# EAGLE schematic 0127_microphone_type_J (EAGLE 9.6.2)

## Sheet 1 of 2
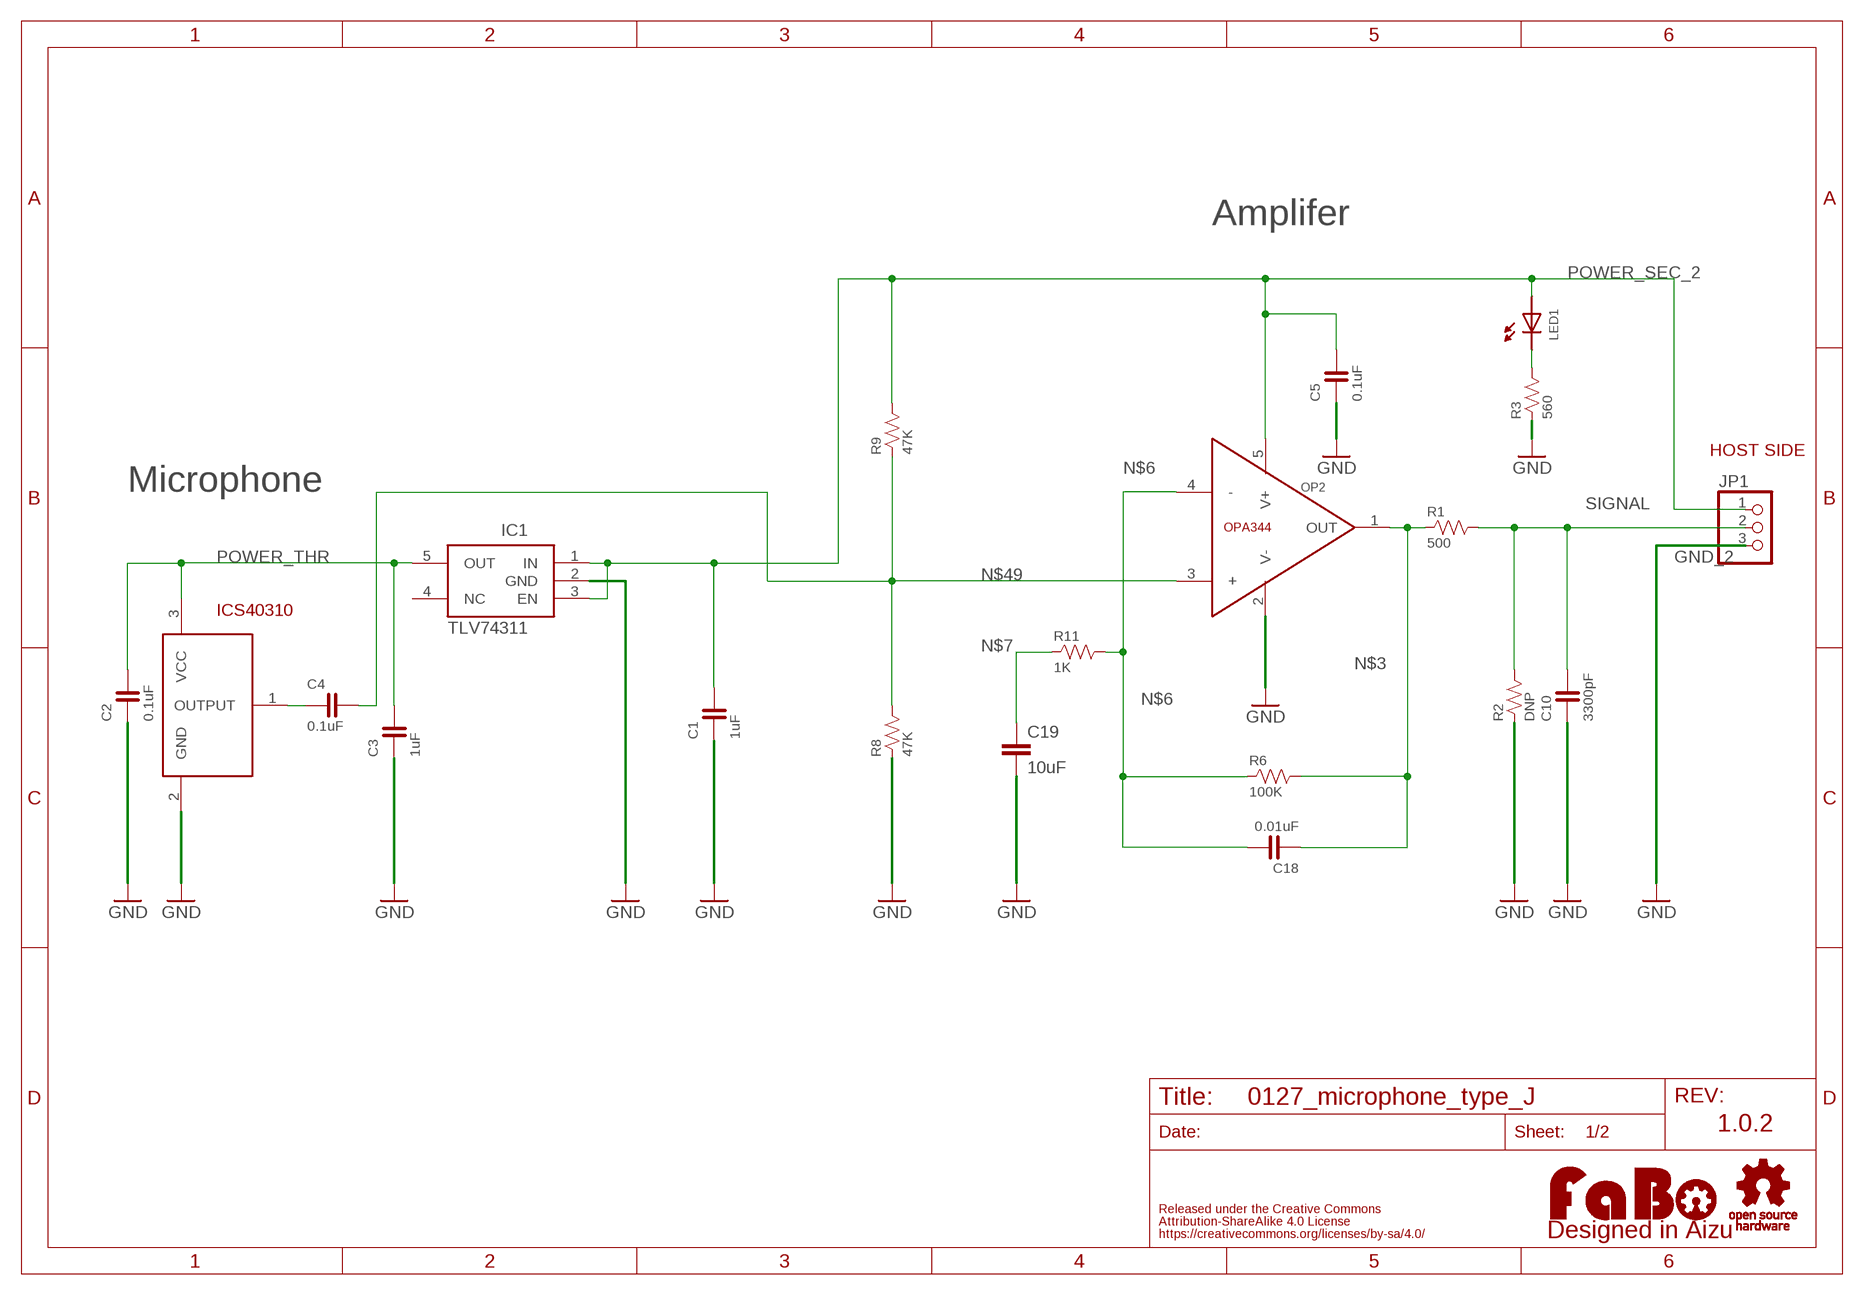
[diagram p0: schematic, sheet 1]

### Parts
C1  1uF  CAPACITOR-0603  [0603]
C2  0.1uF  CAPACITOR-0603  [0603]
C3  1uF  CAPACITOR-0603  [0603]
C4  0.1uF  CAPACITOR-0603  [0603]
C5  0.1uF  CAPACITOR-0603  [0603]
C10  3300pF  CAPACITOR-0603  [0603]
C18  0.01uF  CAPACITOR-0603  [0603]
C19  10uF  C-EUC1206K  [C1206K]
IC1  TLV74311  [SOT-23-5]
ICS40310  ANALOG-MICICS40310  [ICS40310]
JP1  PINHD-1X3  [1X03]
LED1  LED-0603-NARROW  [0603-NARROW]
LOGO1  LOGO_FABO-S  [LOGO_FABO_S]
OP2  OPA344  [SOT23-5]
R1  500  RESISTOR-0603  [0603]
R2  DNP  RESISTOR-0603  [0603]
R3  560  RESISTOR-0603  [0603]
R6  100K  RESISTOR-0603  [0603]
R8  47K  RESISTOR-0603  [0603]
R9  47K  RESISTOR-0603  [0603]
R11  1K  RESISTOR-0603  [0603]
U$2  LOGO_OSHW-S  [LOGO_OSHW_S]

### Nets
GND_2: C1.1 C2.1 C3.1 C5.1 C10.1 C19.2 IC1.2(GND) ICS40310.2(GND) JP1.3 OP2.2(V-) R2.1 R3.1 R8.1 ; supply symbol labelled GND
N$3: C18.1 OP2.1(OUT) R1.1 R6.2
N$4: C4.1 ICS40310.1(OUTPUT)
N$5: LED1.CATHODE R3.2
N$6: C18.2 OP2.4(-) R6.1 R11.2
N$7: C19.1 R11.1
N$49: C4.2 OP2.3(+) R8.2 R9.1
POWER_SEC_2: C1.2 C5.2 IC1.1(IN) IC1.3(EN) JP1.1 LED1.ANODE OP2.5(V+) R9.2
POWER_THR: C2.2 C3.2 IC1.5(OUT) ICS40310.3(VCC)
SIGNAL: C10.2 JP1.2 R1.2 R2.2
Unconnected: IC1.4(NC)

### Notes on the sheet
- Amplifer
- HOST SIDE
- Microphone
- ICS40310
- 1.0.2

## Sheet 2 of 2
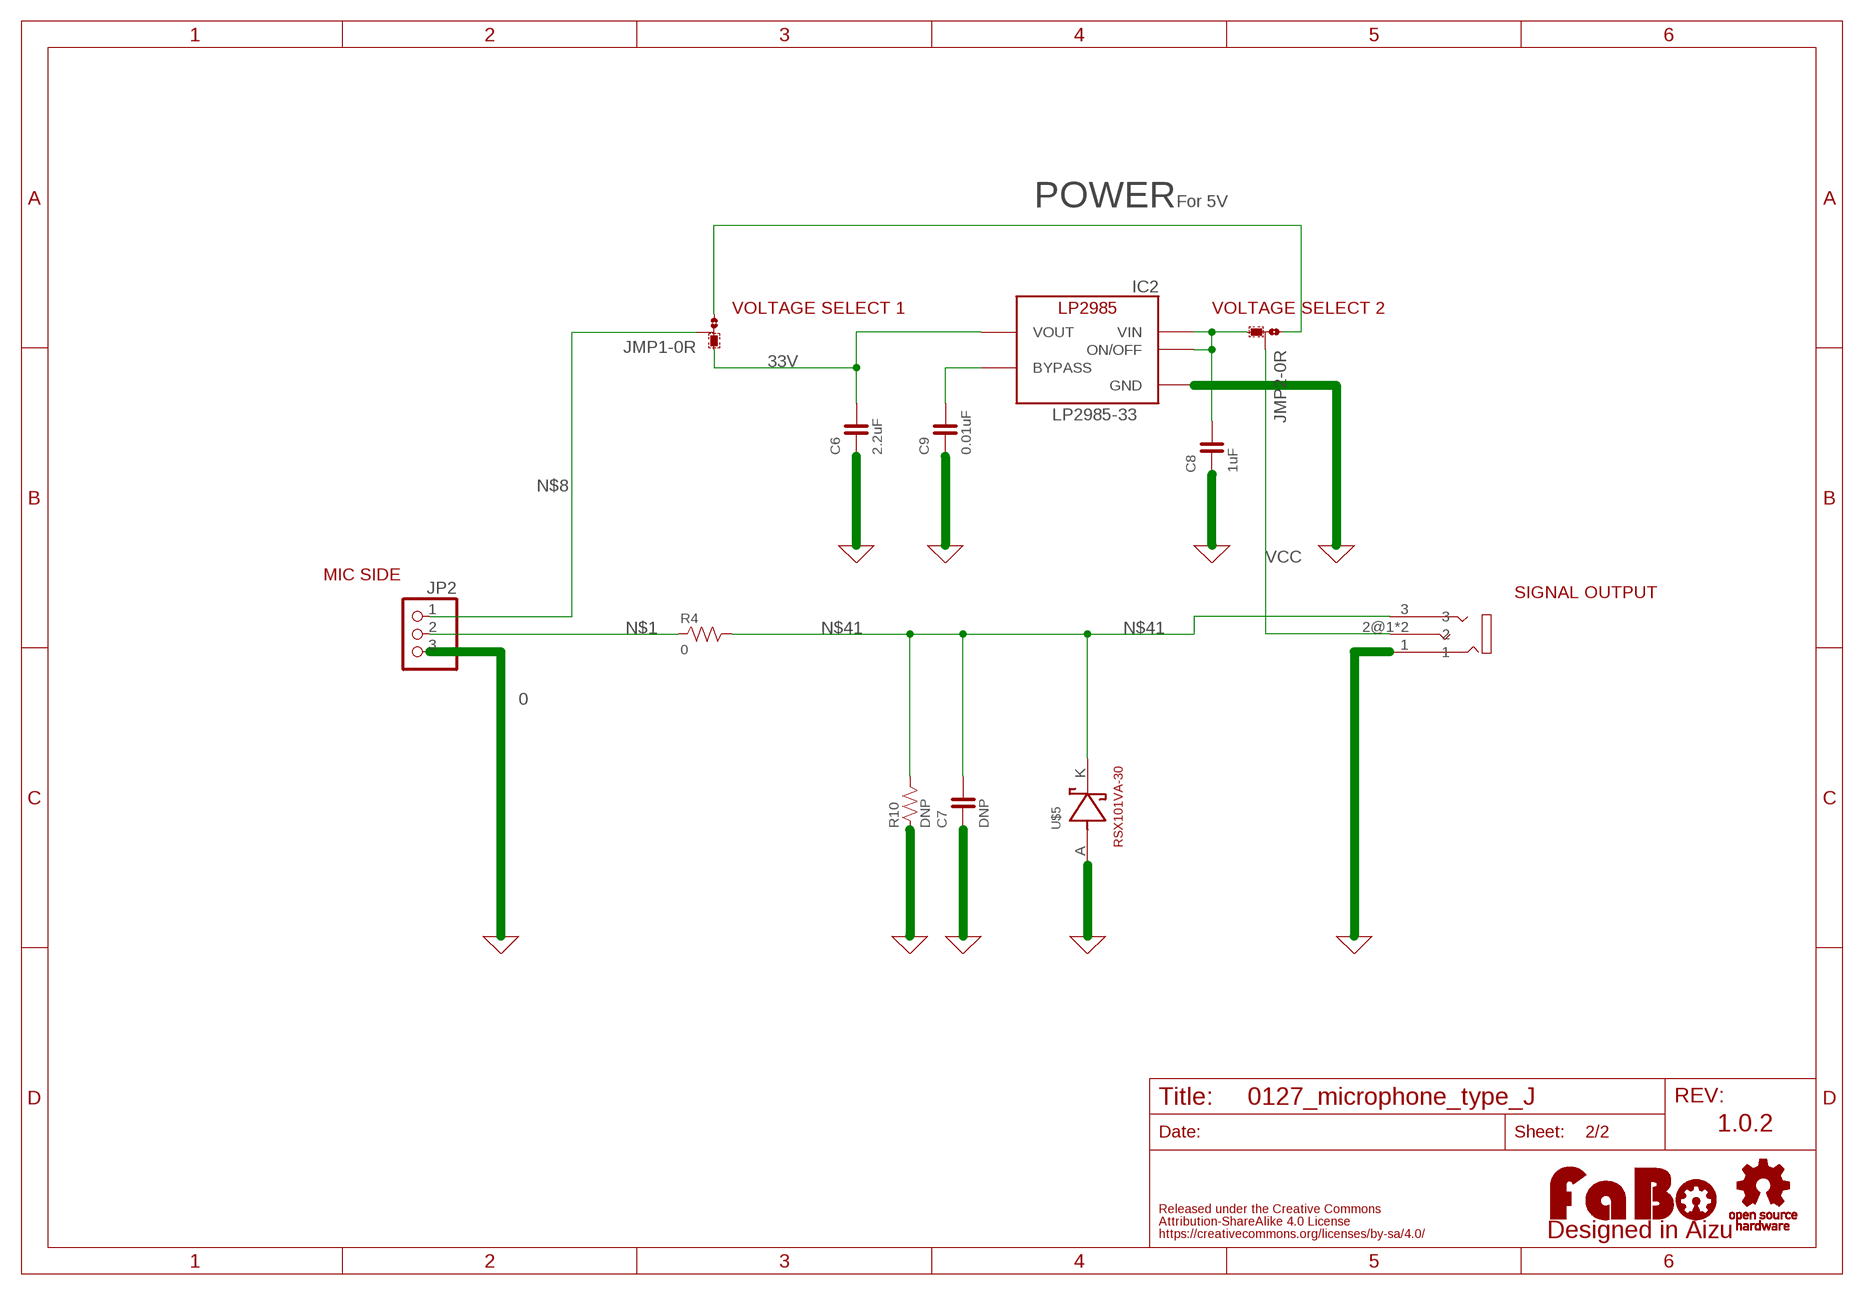
[diagram p1: schematic, sheet 2]

### Parts
C6  2.2uF  CAPACITOR-0603  [0603]
C7  DNP  CAPACITOR-0603  [0603]
C8  1uF  CAPACITOR-0603  [0603]
C9  0.01uF  CAPACITOR-0603  [0603]
IC2  LP2985-33  LP2985-33DBV  [SOT-23-5]
JMP1  0R-JUMPA  [A0R-JMP]
JMP2  0R-JUMPA  [A0R-JMP]
JP2  PINHD-1X3  [1X03]
LOGO2  LOGO_FABO-S  [LOGO_FABO_S]
R4  0  RESISTOR-0603  [0603]
R10  DNP  RESISTOR-0603  [0603]
U$4  MJ8435  [MJ8435]
U$5  RSX101VA-30  [RSX101VA-30]
U$6  LOGO_OSHW-S  [LOGO_OSHW_S]

### Nets
0: C6.1 C7.1 C8.1 C9.1 IC2.2(GND) JP2.3 R10.1 U$4.1 U$5.A(ANODE) ; supply symbol labelled GND
33V: C6.2 IC2.5(VOUT) JMP1.1
N$1: JP2.2 R4.1
N$2: JMP1.3 JMP2.1
N$8: JMP1.2 JP2.1
N$41: C7.2 R4.2 R10.2 U$4.3 U$5.K(CATHODE)
N$42: C9.2 IC2.4(BYPASS)
N$47: C8.2 IC2.1(VIN) IC2.3(ON/OFF) JMP2.3
VCC: JMP2.2 U$4.2@1 U$4.2@2

### Notes on the sheet
- POWER | For 5V
- VOLTAGE SELECT 1 | VOLTAGE SELECT 2
- LP2985-33
- MIC SIDE
- SIGNAL OUTPUT
- 1.0.2

## Library data of the parts
C1-C6 C8 C9 C18 = FaBo-Capacitor:CAPACITOR: CAPACITOR
C7 C10 = FaBo-Capacitor:CAPACITOR: CAPACITOR; SPICEPREFIX: C
C19 = rcl:C-EU: CAPACITOR, European symbol; SPICEPREFIX: C
IC1 = FaBo-Supply:TLV74311
IC2 = FaBo-Supply:LP2985: LP2985
ICS40310 = FaBo-Sound:ANALOG-MIC
JMP1 JMP2 = jump-0r-smd:0R-JUMP: SMD 0R 0805 Jumper
JP1 JP2 = pinhead:PINHD-1X3: PIN HEADER
LED1 = FaBo-LED:LED
LOGO1 LOGO2 = component:LOGO_FABO
OP2 = FaBo-Opamp:OPA344
R1-R4 R6 R8-R11 = FaBo-Resistors:RESISTOR: RESISTOR
U$2 U$6 = component:LOGO_OSHW
U$4 = FaBo-Sound:MJ8435
U$5 = FaBo-Diode:RSX101VA-30